# Altium project Gero_Board.PrjPcb
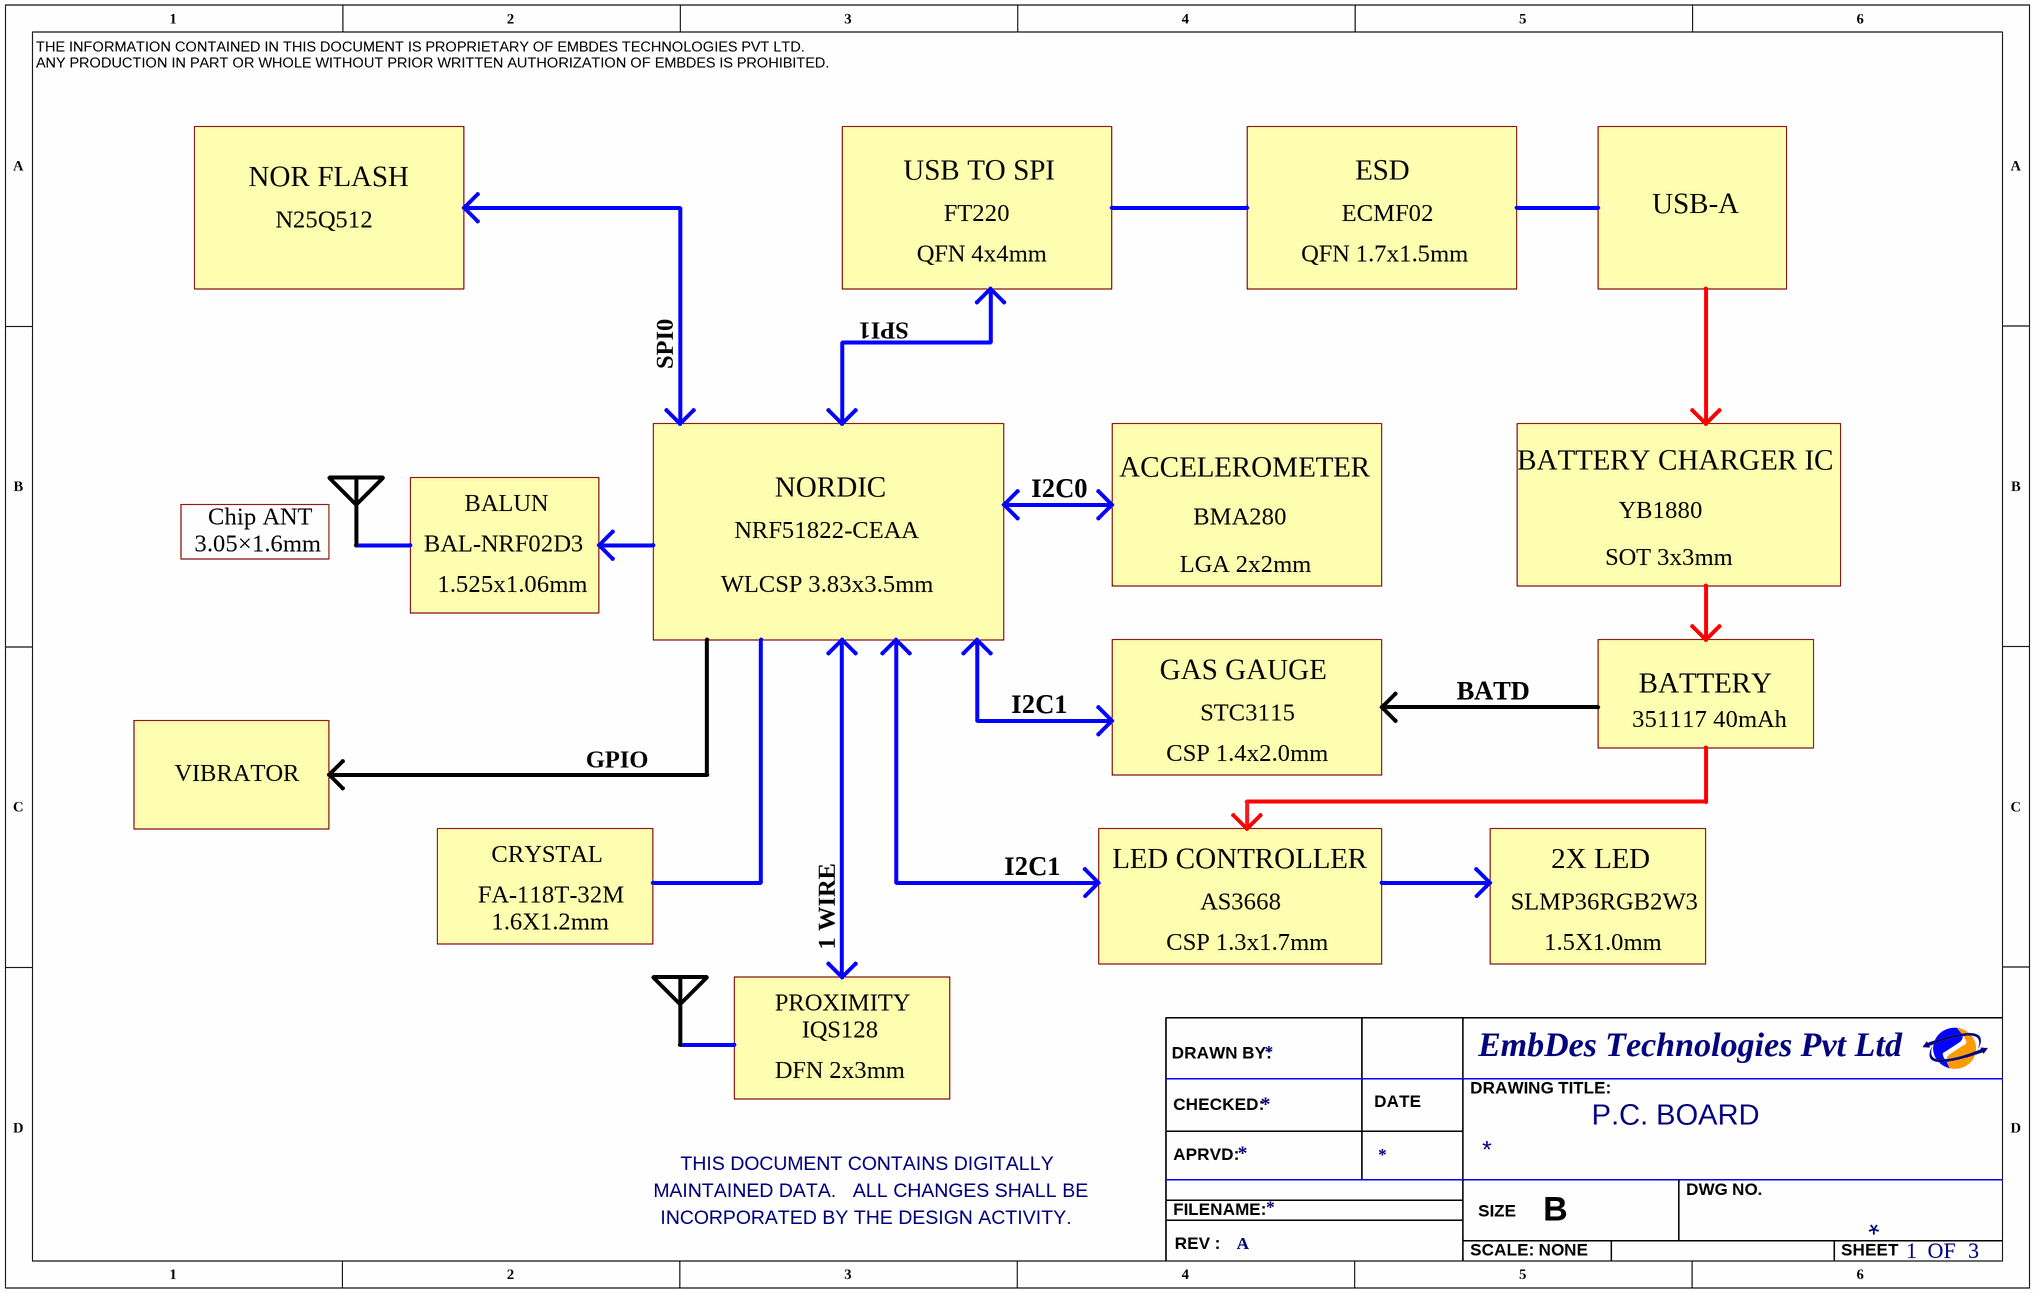
[diagram p0: Gero_Block Diagram.SchDoc]
3 sheets, 71 parts. Net scope: global (net labels, ports and power ports of the same name join across sheets).
Board file: Gero_10Sep1722_10.PcbDoc
Sheets:
  Gero_Block Diagram.SchDoc
  Gero_Board..SchDoc
  Gero_Board2.SchDoc

## Sheet Gero_Block Diagram.SchDoc: P.C. BOARD
size B; Organization: EmbDes; DocumentNumber: 1; Revision: A; SheetNumber: 1; SheetTotal: 3; PageSetup: Record=PageOptions|CenterHorizontal=True|CenterVertical=True|PrintScale=1.35|XCorrection=1.00|YCorrection=1.00|PrintKind=2|BorderSize=5000000|LeftOffset=0|BottomOffset=0|Orientation=2|PaperLength=1000|PaperWidth=1000|Scale=100|PaperSource=7|PrintQuality=-4|MediaType=1|DitherType=10|PaperKind=Letter (8.5 x 11")|PrintScaleMode=1

### Notes on the sheet
- NOR FLASH
- N25Q512
- USB TO SPI
- FT220
- ECMF02
- ESD
- USB-A
- QFN 4x4mm
- QFN 1.7x1.5mm
- SPI0
- SPI1
- NORDIC
- I2C0
- ACCELEROMETER
- BATTERY CHARGER IC
- 3.05×1.6mm
- Chip ANT
- BAL-NRF02D3
- BALUN
- NRF51822-CEAA
- BMA280
- SOT 3x3mm
- YB1880
- 1.525x1.06mm
- WLCSP 3.83x3.5mm
- LGA 2x2mm
- GAS GAUGE
- BATD
- BATTERY
- GPIO
- I2C1
- CSP 1.4x2.0mm
- STC3115
- 351117 40mAh
- VIBRATOR
- FA-118T-32M
- CRYSTAL
- LED CONTROLLER
- AS3668
- SLMP36RGB2W3
- 2X LED
- 1.6X1.2mm
- 1 WIRE
- CSP 1.3x1.7mm
- 1.5X1.0mm
- PROXIMITY
- IQS128
- DFN 2x3mm
- THE INFORMATION CONTAINED IN THIS DOCUMENT IS PROPRIETARY OF EMBDES TECHNOLOGIES PVT LTD.
  ANY PRODUCTION IN PART OR WHOLE WITHOUT PRIOR WRITTEN AUTHORIZATION OF EMBDES IS PROHIBITED.
- DRAWN BY:
- CHECKED:
- DATE
- DRAWING TITLE:
- EmbDes Technologies Pvt Ltd
- THIS DOCUMENT CONTAINS DIGITALLY
- APRVD:
- MAINTAINED DATA.   ALL CHANGES SHALL BE
- INCORPORATED BY THE DESIGN ACTIVITY.
- FILENAME:
- SIZE
- B
- DWG NO.
- REV :
- SCALE: NONE
- SHEET
- OF

## Sheet Gero_Board..SchDoc
size B; SheetNumber: 2; SheetTotal: 3
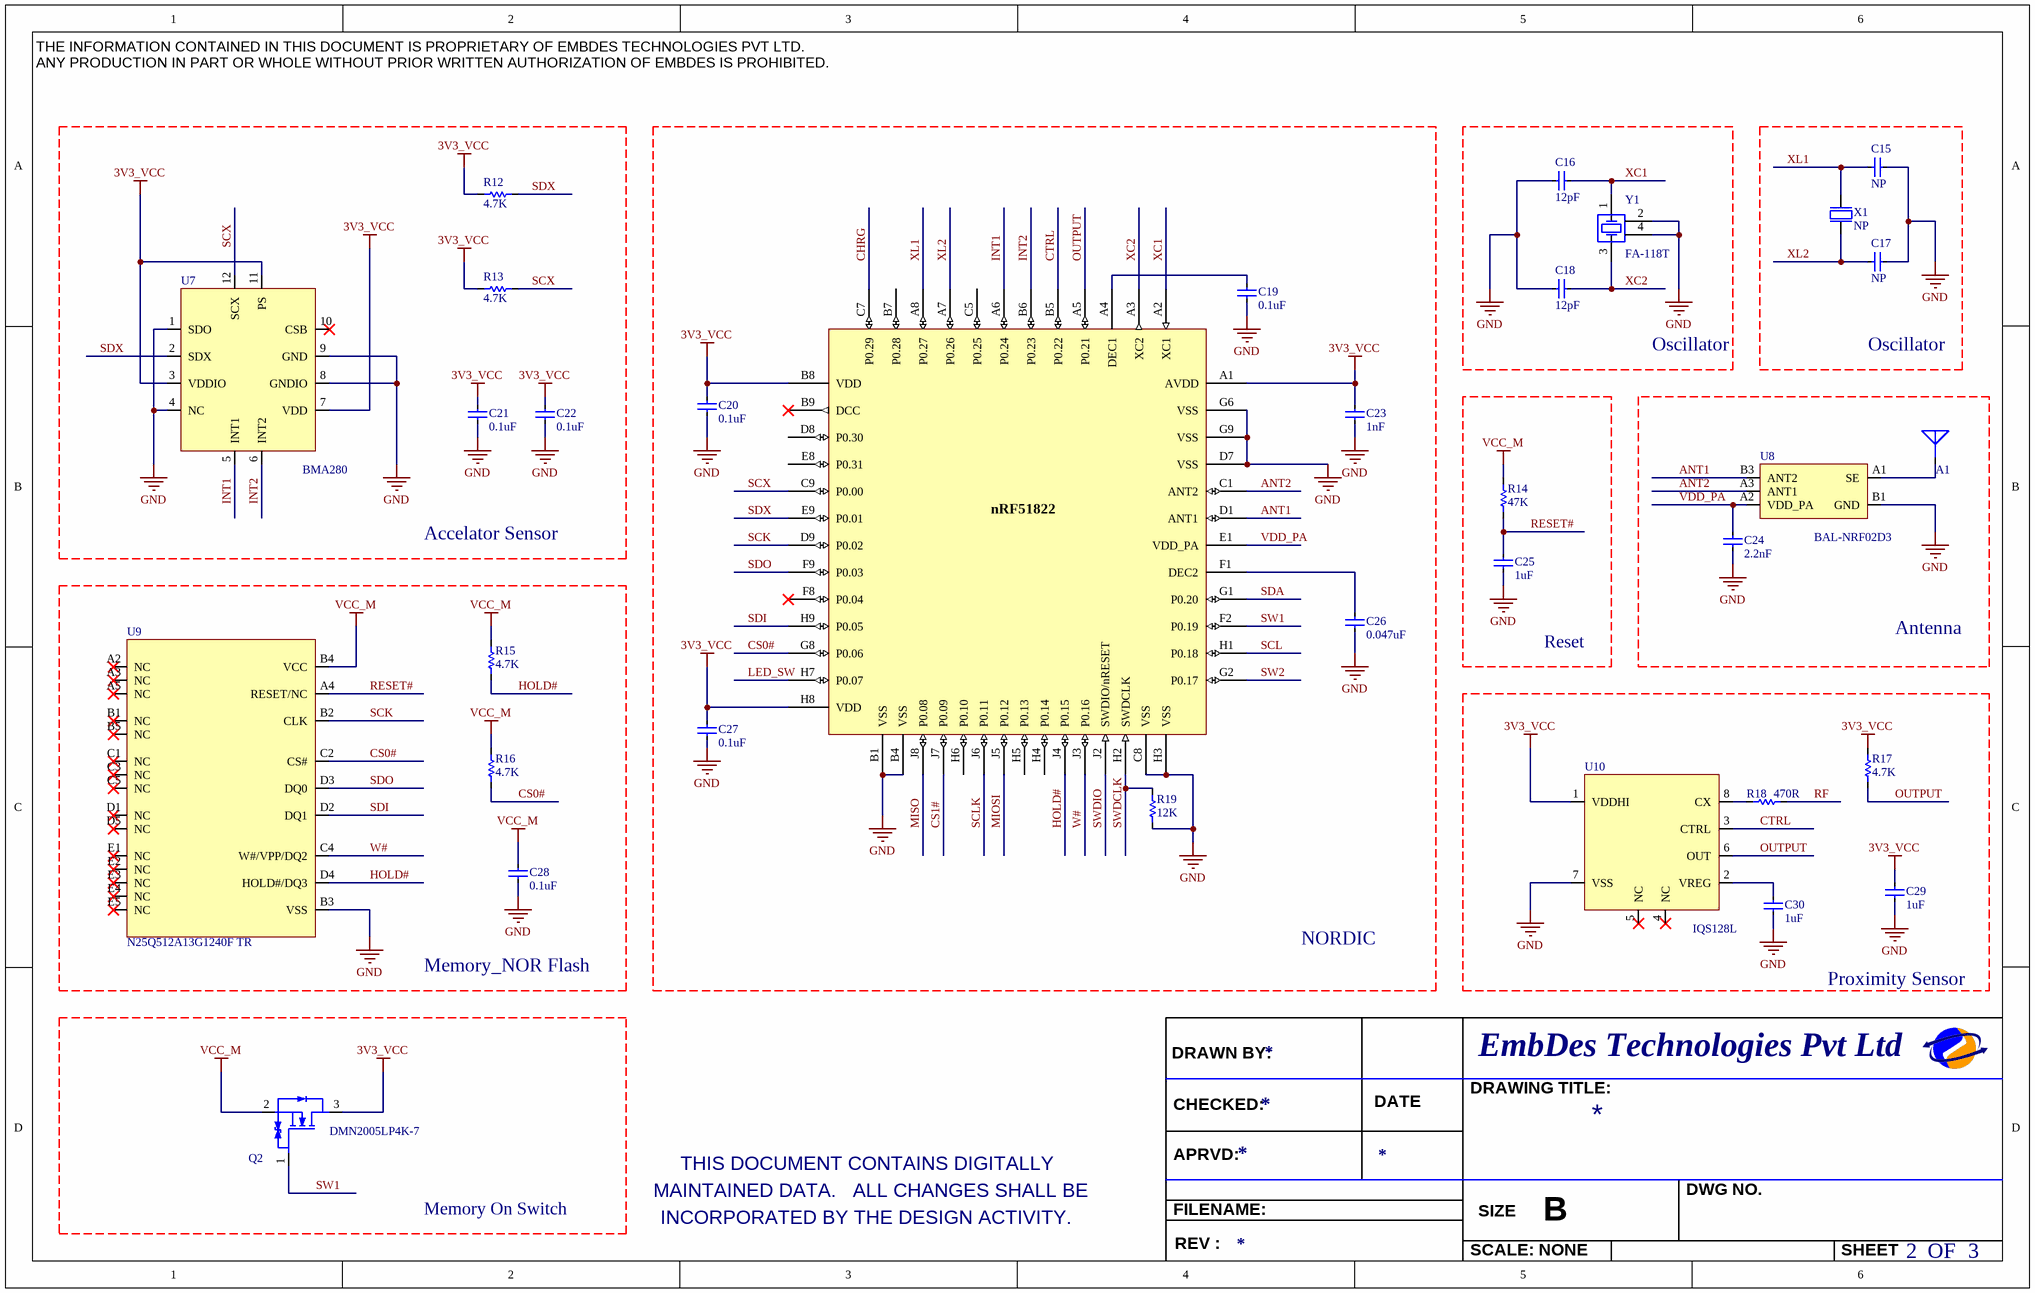
[diagram p1: Gero_Board..SchDoc]

### Parts
*1  ol Bluetooth Low Energy and 2.4GHz proprietary system-on-chip  (value not drawn)
A1  DCAK0008-Dielectric Chip Antenna  (value not drawn)
C15  value NP  [CAPC1005X04L]  (hidden comment: CAP CER 12PF 25V 5% NP0 0201)
C16  value 12pF  [CAPC1005X04L]  (hidden comment: CAP CER 12PF 25V 5% NP0 0201)
C17  value NP  [CAPC1005X04L]  (hidden comment: CAP CER 12PF 25V 5% NP0 0201)
C18  value 12pF  [CAPC1005X04L]  (hidden comment: CAP CER 12PF 25V 5% NP0 0201)
C19  value 0.1uF  [CAPC1005X04L]  (hidden comment: CAP CER 0.1UF 16V 10% X5R 0201)
C20  value 0.1uF  [CAPC1005X04L]  (hidden comment: CAP CER 0.1UF 16V 10% X5R 0201)
C21  value 0.1uF  [CAPC1005X04L]  (hidden comment: CAP CER 0.1UF 16V 10% X5R 0201)
C22  value 0.1uF  [CAPC1005X04L]  (hidden comment: CAP CER 0.1UF 16V 10% X5R 0201)
C23  value 1nF  [CAPC1005X04L]  (hidden comment: CAP CER 1000PF 25V 10% X7R 0201)
C24  value 2.2nF  [CAPC1005X04L]  (hidden comment: CAP CER 2200PF 16V 10% X7R 0201)
C25  value 1uF  [CAPC1005X04L]  (hidden comment: CAP CER 1UF 16V 10% X5R 0402)
C26  value 0.047uF  [CAPC1005X04L]  (hidden comment: CAP CER 0.047UF 16V 10% X6S 0201)
C27  value 0.1uF  [CAPC1005X04L]  (hidden comment: CAP CER 0.1UF 16V 10% X5R 0201)
C28  value 0.1uF  [CAPC1005X04L]  (hidden comment: CAP CER 0.1UF 16V 10% X5R 0201)
C29  value 1uF  [CAPC1005X04L]  (hidden comment: CAP CER 1UF 16V 10% X5R 0402)
C30  value 1uF  [CAPC1005X04L]  (hidden comment: CAP CER 1UF 16V 10% X5R 0402)
Q2  MFG PART NO: DMN2005LP4K-7  (hidden comment: MOSFET N-CH 20V 200MA 3-DFN)
R12  value 4.7K  [R0402]  (hidden comment: RES 4.7K OHM 1/20W 1% 0201 SMD)
R13  value 4.7K  [R0402]  (hidden comment: RES 4.7K OHM 1/20W 1% 0201 SMD)
R14  value 47K  [R0402]  (hidden comment: RES 47K OHM 1/20W 1% 0201 SMD)
R15  value 4.7K  [R0402]  (hidden comment: RES 4.7K OHM 1/20W 1% 0201 SMD)
R16  value 4.7K  [R0402]  (hidden comment: RES 4.7K OHM 1/20W 1% 0201 SMD)
R17  value 4.7K  [R0402]  (hidden comment: RES 4.7K OHM 1/20W 1% 0201 SMD)
R18  value 470R  [R0402]  (hidden comment: RES 470 OHM 1/20W 1% 0201 SMD)
R19  value 12K  [R0402]  (hidden comment: RES 12K OHM 1/20W 1% 0201 SMD)
U7  Manufacturer Part Number: BMA280  (hidden comment: SENSOR ACCELEROMETER)
U8  50 ohm balun transformer for 2.45GHz ISM  [BAL-NRF02D3]  (value not drawn)
U9  Manufacturer Part Number: N25Q512A13G1240F TR  [N25Q512A13G1240F]  (hidden comment: IC FLASH 128MX4 SLC TBGA DDP)
U10  Manufacturer Part No: IQS128L  [IQS128]  (hidden comment: Single Channel Capacitive Proximity/Touch Controller)
X1  value NP  (hidden comment: xtal)
Y1  MHz Range Crystal Unit Ultra Miniature Size Low Profile SMD  [FA-118T]  (value not drawn)

### Nets
3V3_VCC: *1.A1(AVDD) *1.B8(VDD) *1.H8(VDD) C20.2 C21.2 C22.2 C23.2 C27.2 C29.2 Q2.3(D) R12.1 R13.1 R17.2 U7.3(VDDIO) U7.7(VDD) U7.11(PS) U10.1(VDDHI)
GND: *1.B1(VSS) *1.B4(VSS) *1.C8(VSS) *1.D7(VSS) *1.G6(VSS) *1.G9(VSS) *1.H3(VSS) C15.2 C16.1 C17.2 C18.1 C19.1 C20.1 C21.1 C22.1 C23.1 C24.1 C25.1 C26.1 C27.1 C28.1 C29.1 C30.1 R19.1 U7.1(SDO) U7.4(NC) U7.8(GNDIO) U7.9(GND) U8.B1(GND) U9.B3(VSS) U10.7(VSS) Y1.2(GND) Y1.4(GND)
VCC_M: C28.2 Q2.2(S) R14.2 R15.2 R16.2 U9.B4(VCC)
ANT1: *1.D1(ANT1) U8.B3(ANT2)
ANT2: *1.C1(ANT2) U8.A3(ANT1)
CHRG: *1.C7(P0.29)
CS0#: *1.G8(P0.06) R16.1 U9.C2(CS#)
CS1#: *1.J7(P0.09)
CTRL: *1.B5(P0.22) U10.3(CTRL)
HOLD#: *1.J4(P0.15) R15.1 U9.D4(HOLD#/DQ3)
INT1: *1.A6(P0.24) U7.5(INT1)
INT2: *1.B6(P0.23) U7.6(INT2)
LED_SW: *1.H7(P0.07)
MIOSI: *1.J5(P0.12)
MISO: *1.J8(P0.08)
OUTPUT: *1.A5(P0.21) R17.1 U10.6(OUT)
RESET#: C25.2 R14.1 U9.A4(RESET/NC)
RF: R18.2
SCK: *1.D9(P0.02) U9.B2(CLK)
SCL: *1.H1(P0.18)
SCLK: *1.J6(P0.11)
SCX: *1.C9(P0.00) R13.2 U7.12(SCX)
SDA: *1.G1(P0.20)
SDI: *1.H9(P0.05) U9.D2(DQ1)
SDO: *1.F9(P0.03) U9.D3(DQ0)
SDX: *1.E9(P0.01) R12.2 U7.2(SDX)
SW1: *1.F2(P0.19) Q2.1(G)
SW2: *1.G2(P0.17)
SWDCLK: *1.H2(SWDCLK) R19.2
SWDIO: *1.J2(SWDIO/nRESET)
VDD_PA: *1.E1(VDD_PA) C24.2 U8.A2(VDD_PA)
W#: *1.J3(P0.16) U9.C4(W#/VPP/DQ2)
XC1: *1.A2(XC1) C16.2 Y1.1(XTAL_IN)
XC2: *1.A3(XC2) C18.2 Y1.3(XTAL_OUT)
XL1: *1.A8(P0.27) C15.1 X1.1(inp)
XL2: *1.A7(P0.26) C17.1 X1.3(out)
Net*1_A4: *1.A4(DEC1) C19.2
Net*1_F1: *1.F1(DEC2) C26.2
NetC30_2: C30.2 U10.2(VREG)
NetR18_1: R18.1 U10.8(CX)

Not connected (* = marked no-connect by the designer): *1 B7(P0.28) B9(DCC)* C5(P0.25) D8(P0.30) E8(P0.31) F8(P0.04)* H4(P0.14) H5(P0.13) H6(P0.10); A1 1(A); U7 10(CSB)*; U8 A1(SE); U9 A2(NC)* A3(NC)* A5(NC)* B1(NC)* B5(NC)* C1(NC)* C3(NC)* C5(NC)* D1(NC)* D5(NC)* E1(NC)* E2(NC)* E3(NC)* E4(NC)* E5(NC)*; U10 4(NC)* 5(NC)*

### Notes on the sheet
- Oscillator
- Accelator Sensor
- Antenna
- Reset
- Memory_NOR Flash
- NORDIC
- Proximity Sensor
- Memory On Switch
- THE INFORMATION CONTAINED IN THIS DOCUMENT IS PROPRIETARY OF EMBDES TECHNOLOGIES PVT LTD.
  ANY PRODUCTION IN PART OR WHOLE WITHOUT PRIOR WRITTEN AUTHORIZATION OF EMBDES IS PROHIBITED.
- DRAWN BY:
- CHECKED:
- DATE
- DRAWING TITLE:
- EmbDes Technologies Pvt Ltd
- THIS DOCUMENT CONTAINS DIGITALLY
- APRVD:
- MAINTAINED DATA.   ALL CHANGES SHALL BE
- INCORPORATED BY THE DESIGN ACTIVITY.
- FILENAME:
- SIZE
- B
- DWG NO.
- REV :
- SCALE: NONE
- SHEET
- OF
- (in symbol ol Bluetooth Low Energy and 2.4GHz proprietary system-on-chip) nRF51822

### Library data of the parts
A1 = DCAK0008-Dielectric Chip Antenna: Manufacturer: CIROCOMM TECHNOLOGY; Manufacuturer Part No: 03A40D5M00J0110
C15-C18 = CAP CER 12PF 25V 5% NP0 0201: Manufacturer: TDK Corporation; Manufacturer Part Number: C0603C0G1E120J030BA; Voltage: 25V
C19-C22 C27 C28 = CAP CER 0.1UF 16V 10% X5R 0201: Manufacturer: TDK Corporation; Manufacturer Part Number: C0603X5R1C104K030BC; Voltage: 16V
C23 = CAP CER 1000PF 25V 10% X7R 0201: Manufacturer: TDK Corporation; Manufacturer Part Number: C0603X7R1E102K030BA; Voltage: 25V
C24 = CAP CER 2200PF 16V 10% X7R 0201: Manufacturer: TDK Corporation; Manufacturer Part Number: C0603X7R1C222K030BA; Voltage: 16V
C25 C29 C30 = CAP CER 1UF 16V 10% X5R 0402: Manufacturer: TDK Corporation; Manufacturer Part Number: C1005X5R1C105K050BC; Note: 16V
C26 = CAP CER 0.047UF 16V 10% X6S 0201: Manufacturer: TDK Corporation; Manufacturer Part Number: C0603X6S1C473K030BC; Voltage: 16V
Q2 = MOSFET N-CH 20V 200MA 3-DFN: MANUFACTURER: Diodes Inc
R12 R13 R15-R17 = RES 4.7K OHM 1/20W 1% 0201 SMD: Manufacturer Part Number_1: ERJ-1GEF4701C; Manufacturer: Panasonic Electronic Components; Package: R0201
R14 = RES 47K OHM 1/20W 1% 0201 SMD: Manufacturer Part Number_1: ERJ-1GEF4702C; Manufacturer: Panasonic Electronic Components; Package: R0201
R18 = RES 470 OHM 1/20W 1% 0201 SMD: Manufacturer Part Number_1: ERJ-1GEF4700C; Manufacturer: Panasonic Electronic Components; Package: R0201
R19 = RES 12K OHM 1/20W 1% 0201 SMD: Manufacturer Part Number_1: ERJ-1GEF1202C; Manufacturer_1: Panasonic Electronic Components; Package: R0201
U7 = SENSOR ACCELEROMETER: Manufacturer: Bosch Sensortec
U8 = 50 ohm balun transformer for 2.45GHz ISM: Manufacturer: ST Microelectronics; Manufacturer Part Number: BAL-NRF02D3
U9 = IC FLASH 128MX4 SLC TBGA DDP: Manufacturer: Micron Technology Inc
U10 = Single Channel Capacitive Proximity/Touch Controller: Manufacturer: Azoteq
Y1 = MHz Range Crystal Unit Ultra Miniature Size Low Profile SMD: Manufacturer: EPSON; Manufacturer Part Number: FA-118T
X1 = xtal: Manufacturer: *; Manufacturer Part Number: *

## Sheet Gero_Board2.SchDoc
size B; SheetNumber: 3; SheetTotal: 3
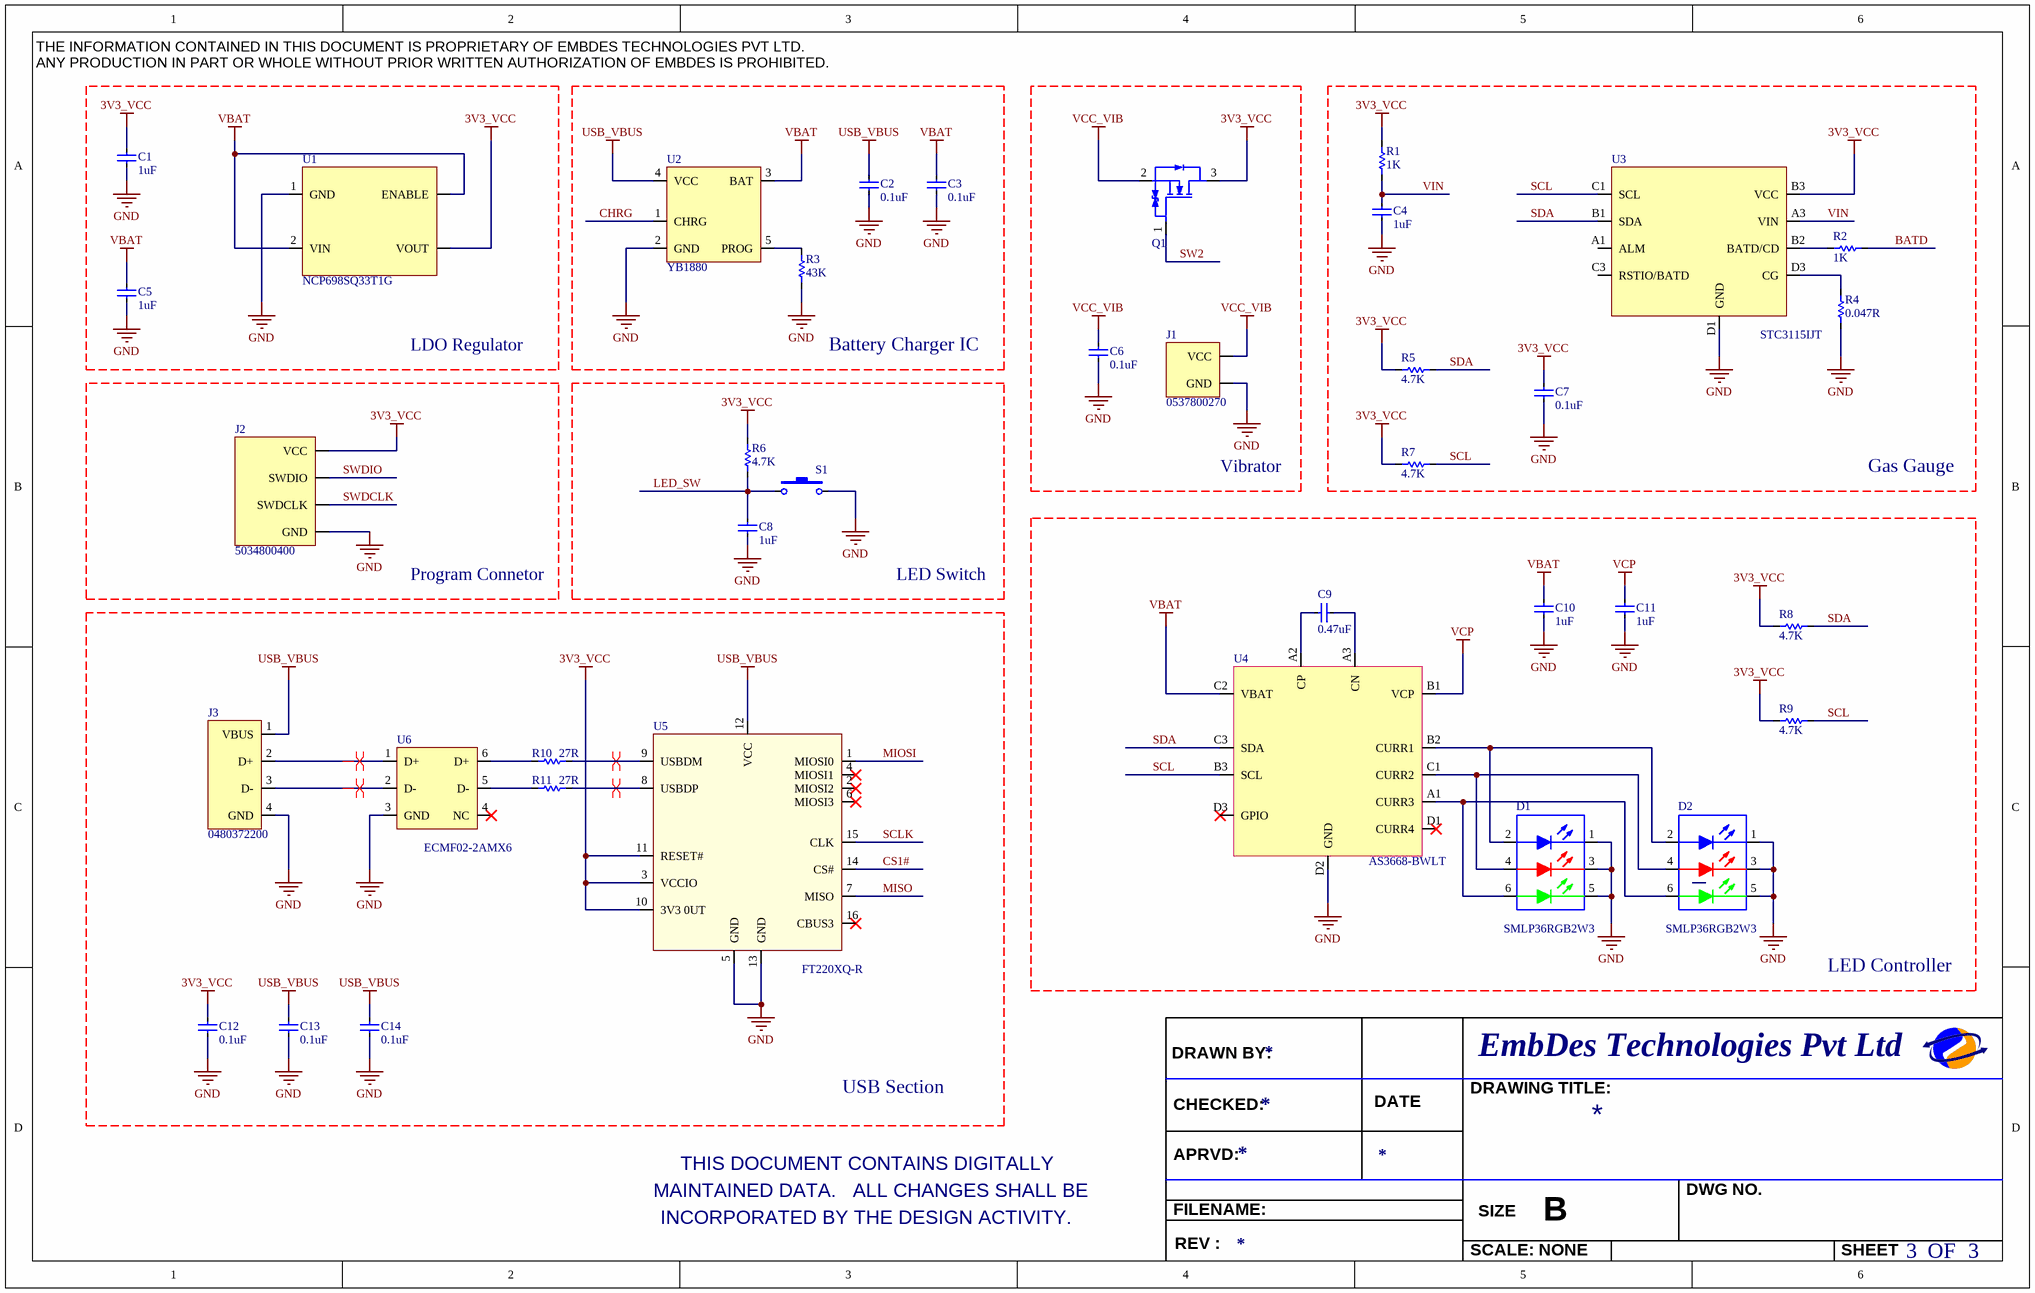
[diagram p2: Gero_Board2.SchDoc]

### Parts
C1  value 1uF  [CAPC1005X04L]  (hidden comment: CAP CER 1UF 16V 10% X5R 0402)
C2  value 0.1uF  [CAPC1005X04L]  (hidden comment: CAP CER 0.1UF 16V 10% X5R 0201)
C3  value 0.1uF  [CAPC1005X04L]  (hidden comment: CAP CER 0.1UF 16V 10% X5R 0201)
C4  value 1uF  [CAPC1005X04L]  (hidden comment: CAP CER 1UF 16V 10% X5R 0402)
C5  value 1uF  [CAPC1005X04L]  (hidden comment: CAP CER 1UF 16V 10% X5R 0402)
C6  value 0.1uF  [CAPC1005X04L]  (hidden comment: CAP CER 0.1UF 16V 10% X5R 0201)
C7  value 0.1uF  [CAPC1005X04L]  (hidden comment: CAP CER 0.1UF 16V 10% X5R 0201)
C8  value 1uF  [CAPC1005X04L]  (hidden comment: CAP CER 1UF 16V 10% X5R 0402)
C9  value 0.47uF  [CAPC1005X04L]  (hidden comment: CAP CER 0.47UF 10V 20% JB 0201)
C10  value 1uF  [CAPC1005X04L]  (hidden comment: CAP CER 1UF 16V 10% X5R 0402)
C11  value 1uF  [CAPC1005X04L]  (hidden comment: CAP CER 1UF 16V 10% X5R 0402)
C12  value 0.1uF  [CAPC1005X04L]  (hidden comment: CAP CER 0.1UF 16V 10% X5R 0201)
C13  value 0.1uF  [CAPC1005X04L]  (hidden comment: CAP CER 0.1UF 16V 10% X5R 0201)
C14  value 0.1uF  [CAPC1005X04L]  (hidden comment: CAP CER 0.1UF 16V 10% X5R 0201)
D1  Manufacturer Part Number: SMLP36RGB2W3  [VLMG1300-GS08]  (hidden comment: LED PICOLED RGB 5MA 1510)
D2  Manufacturer Part Number: SMLP36RGB2W3  [VLMG1300-GS08]  (hidden comment: LED PICOLED RGB 5MA 1510)
J1  Manufacturer Part Number: 0537800270  (hidden comment: CONN HEADER 2POS 1.25MM R/A SMD)
J2  Manufacturer Part Number: 5034800400  (hidden comment: CONN .5MM FPC 4POS RA SMD B-FLIP)
J3  Manufacturer Part Number: 0480372200  (hidden comment: CONN PLUG USB A 4POS SMD R/A)
Q1  MOSFET N-CH 20V 200MA 3-DFN  (value not drawn)
R1  value 1K  [R0402]  (hidden comment: RES 1K OHM 1/20W 1% 0201 SMD)
R2  value 1K  [R0402]  (hidden comment: RES 1K OHM 1/20W 1% 0201 SMD)
R3  value 43K  [R0402]  (hidden comment: RES 43K OHM 1/20W 1% 0201 SMD)
R4  value 0.047R  [R0402]  (hidden comment: RES 0.047 OHM 1/4W 1% 0402 SMD)
R5  value 4.7K  [R0402]  (hidden comment: RES 4.7K OHM 1/20W 1% 0201 SMD)
R6  value 4.7K  [R0402]  (hidden comment: RES 4.7K OHM 1/20W 1% 0201 SMD)
R7  value 4.7K  [R0402]  (hidden comment: RES 4.7K OHM 1/20W 1% 0201 SMD)
R8  value 4.7K  [R0402]  (hidden comment: RES 4.7K OHM 1/20W 1% 0201 SMD)
R9  value 4.7K  [R0402]  (hidden comment: RES 4.7K OHM 1/20W 1% 0201 SMD)
R10  value 27R  [R0402]  (hidden comment: RES 27 OHM 1/20W 1% 0201 SMD)
R11  value 27R  [R0402]  (hidden comment: RES 27 OHM 1/20W 1% 0201 SMD)
S1  SW-PB  (value not drawn)
U1  Manufacturer Part Number: NCP698SQ33T1G  (hidden comment: IC REG LDO 3.3V 0.28A SC82AB)
U2  Manufacturer Part Number: YB1880  [YB1880ST25P]  (hidden comment: Standalone Linear Lithium Battery Charger)
U3  Manufacturer Part Number: STC3115IJT  [STC3115]  (hidden comment: IC GAS GAUGE LI-ION/POL 10CSP)
U4  Manufacturer Part Number: AS3668-BWLT  [AS3668  CSP 1.3x1.7mm]  (hidden comment: 4 Channel Breathlight Controller)
U5  Manufacturer Part Number: FT220XQ-R  [FT220 XQ-R]  (hidden comment: IC USB 4 BIT SPI/FT1248 16QFN)
U6  Manufacturer Part Number: ECMF02-2AMX6  (hidden comment: IC ESD FILTER COMM MODE 6-UQFN)

### Nets
3V3_VCC: C1.2 C7.2 C12.2 J2.1(VCC) Q1.3(D) R1.2 R5.1 R6.2 R7.1 R8.1 R9.1 U1.4(VOUT) U3.B3(VCC) U5.3(VCCIO) U5.10(3V3_0UT) U5.11(RESET#)
GND: C1.1 C2.1 C3.1 C4.2 C5.1 C6.1 C7.1 C8.1 C10.1 C11.1 C12.1 C13.1 C14.1 D1.1(K) D1.3(K) D1.5(K) D2.1(K) D2.3(K) D2.5(K) J1.2(GND) J2.4(GND) J3.4(GND) R3.1 R4.1 S1.2 U1.1(GND) U2.2(GND) U3.D1(GND) U4.D2(GND) U5.5(GND) U5.13(GND) U6.3(GND)
USB_VBUS: C2.2 C13.2 C14.2 J3.1(VBUS) U2.4(VCC) U5.12(VCC)
VBAT: C3.2 C5.2 C10.2 U1.2(VIN) U1.3(ENABLE) U2.3(BAT) U4.C2(VBAT)
VCC_VIB: C6.2 J1.1(VCC) Q1.2(S)
VCP: C11.2 U4.B1(VCP)
BATD: R2.1
CHRG: U2.1(CHRG)
CS1#: U5.14(CS#)
LED_SW: C8.2 R6.1 S1.1
MIOSI: U5.1(MIOSI0)
MISO: U5.7(MISO)
SCL: R7.2 R9.2 U3.C1(SCL) U4.B3(SCL)
SCLK: U5.15(CLK)
SDA: R5.2 R8.2 U3.B1(SDA) U4.C3(SDA)
SW2: Q1.1(G)
SWDCLK: J2.3(SWDCLK)
SWDIO: J2.2(SWDIO)
VIN: C4.1 R1.1 U3.A3(VIN)
NetC9_1: C9.1 U4.A2(CP)
NetC9_2: C9.2 U4.A3(CN)
NetD1_2: D1.2(A) D2.2(A) U4.B2(CURR1)
NetD1_4: D1.4(A) D2.4(A) U4.C1(CURR2)
NetD1_6: D1.6(A) D2.6(A) U4.A1(CURR3)
NetJ3_2: J3.2(D+) U6.1(D+)
NetJ3_3: J3.3(D-) U6.2(D-)
NetR2_2: R2.2 U3.B2(BATD/CD)
NetR3_2: R3.2 U2.5(PROG)
NetR4_2: R4.2 U3.D3(CG)
NetR10_1: R10.1 U6.6(D+)
NetR10_2: R10.2 U5.9(USBDM)
NetR11_1: R11.1 U6.5(D-)
NetR11_2: R11.2 U5.8(USBDP)

Not connected (* = marked no-connect by the designer): U3 A1(ALM) C3(RSTIO/BATD); U4 D1(CURR4)* D3(GPIO)*; U5 2(MIOSI2)* 4(MIOSI1)* 6(MIOSI3)* 16(CBUS3)*; U6 4(NC)*

### Layout directives
differential pair: NetJ3_2, NetJ3_3, NetR10_2, NetR11_2

### Notes on the sheet
- LDO Regulator
- Battery Charger IC
- Vibrator
- Gas Gauge
- Program Connetor
- LED Switch
- LED Controller
- USB Section
- THE INFORMATION CONTAINED IN THIS DOCUMENT IS PROPRIETARY OF EMBDES TECHNOLOGIES PVT LTD.
  ANY PRODUCTION IN PART OR WHOLE WITHOUT PRIOR WRITTEN AUTHORIZATION OF EMBDES IS PROHIBITED.
- DRAWN BY:
- CHECKED:
- DATE
- DRAWING TITLE:
- EmbDes Technologies Pvt Ltd
- THIS DOCUMENT CONTAINS DIGITALLY
- APRVD:
- MAINTAINED DATA.   ALL CHANGES SHALL BE
- INCORPORATED BY THE DESIGN ACTIVITY.
- FILENAME:
- SIZE
- B
- DWG NO.
- REV :
- SCALE: NONE
- SHEET
- OF

### Library data of the parts
C1 C4 C5 C8 C10 C11 = CAP CER 1UF 16V 10% X5R 0402: as C25 on sheet Gero_Board.; Note: 16V
C2 C3 C6 C7 C12-C14 = CAP CER 0.1UF 16V 10% X5R 0201: as C19 on sheet Gero_Board.; Voltage: 16V
C9 = CAP CER 0.47UF 10V 20% JB 0201: Manufacturer: TDK Corporation; Manufacturer Part Number: C0603JB1A474M030BC; Voltage: 10V
D1 D2 = LED PICOLED RGB 5MA 1510: Manufacturer: Rohm Semiconductor
J1 = CONN HEADER 2POS 1.25MM R/A SMD: Manufacturer: Molex Inc
J2 = CONN .5MM FPC 4POS RA SMD B-FLIP: Manufacturer: Molex Inc
J3 = CONN PLUG USB A 4POS SMD R/A: Manufacturer: Molex Inc
Q1 = MOSFET N-CH 20V 200MA 3-DFN: MANUFACTURER: Diodes Inc; MFG PART NO: DMN2005LP4K-7
R1 R2 = RES 1K OHM 1/20W 1% 0201 SMD: Manufacturer Part Number_1: ERJ-1GEF1001C; Manufacturer_1: Panasonic Electronic Components; Package: R0201
R3 = RES 43K OHM 1/20W 1% 0201 SMD: Manufacturer Part Number: ERJ-1GEF4302C; Manufacturer: Panasonic Electronic Components; Package: R0402
R4 = RES 0.047 OHM 1/4W 1% 0402 SMD: Manufacturer Part Number_1: ERJ-2BWFR047X; Manufacturer_1: Panasonic Electronic Components; Package: R0402
R5-R9 = RES 4.7K OHM 1/20W 1% 0201 SMD: as R12 on sheet Gero_Board.; Package: R0201
R10 R11 = RES 27 OHM 1/20W 1% 0201 SMD: Manufacturer Part Number: ERJ-1GEF27R0C; Manufacturer: Panasonic Electronic Components; Package: R0201
S1 = SW-PB: Switch; Manufacturer: *; Manufacturer Part No: *
U1 = IC REG LDO 3.3V 0.28A SC82AB: Manufacturer: ON Semiconductor
U2 = Standalone Linear Lithium Battery Charger: Manufacturer: YOBON TECHNOLOGIES; Package Type: SOT23-5
U3 = IC GAS GAUGE LI-ION/POL 10CSP: Manufacturer: STMicroelectronics
U4 = 4 Channel Breathlight Controller: Manufacturer: AMS
U5 = IC USB 4 BIT SPI/FT1248 16QFN: Manufacturer: FTDI, Future Technology Devices International Ltd; Package: 16-WQFN
U6 = IC ESD FILTER COMM MODE 6-UQFN: Manufacturer: STMicroelectronics

## Nets that join several sheets
3V3_VCC: Gero_Board. (17 pins), Gero_Board2 (16 pins)
GND: Gero_Board. (33 pins), Gero_Board2 (32 pins)
CHRG: Gero_Board. (*1.C7), Gero_Board2 (U2.1)
CS1#: Gero_Board. (*1.J7), Gero_Board2 (U5.14)
LED_SW: Gero_Board. (*1.H7), Gero_Board2 (C8.2 R6.1 S1.1)
MIOSI: Gero_Board. (*1.J5), Gero_Board2 (U5.1)
MISO: Gero_Board. (*1.J8), Gero_Board2 (U5.7)
SCL: Gero_Board. (*1.H1), Gero_Board2 (R7.2 R9.2 U3.C1 U4.B3)
SCLK: Gero_Board. (*1.J6), Gero_Board2 (U5.15)
SDA: Gero_Board. (*1.G1), Gero_Board2 (R5.2 R8.2 U3.B1 U4.C3)
SW2: Gero_Board. (*1.G2), Gero_Board2 (Q1.1)
SWDCLK: Gero_Board. (*1.H2 R19.2), Gero_Board2 (J2.3)
SWDIO: Gero_Board. (*1.J2), Gero_Board2 (J2.2)